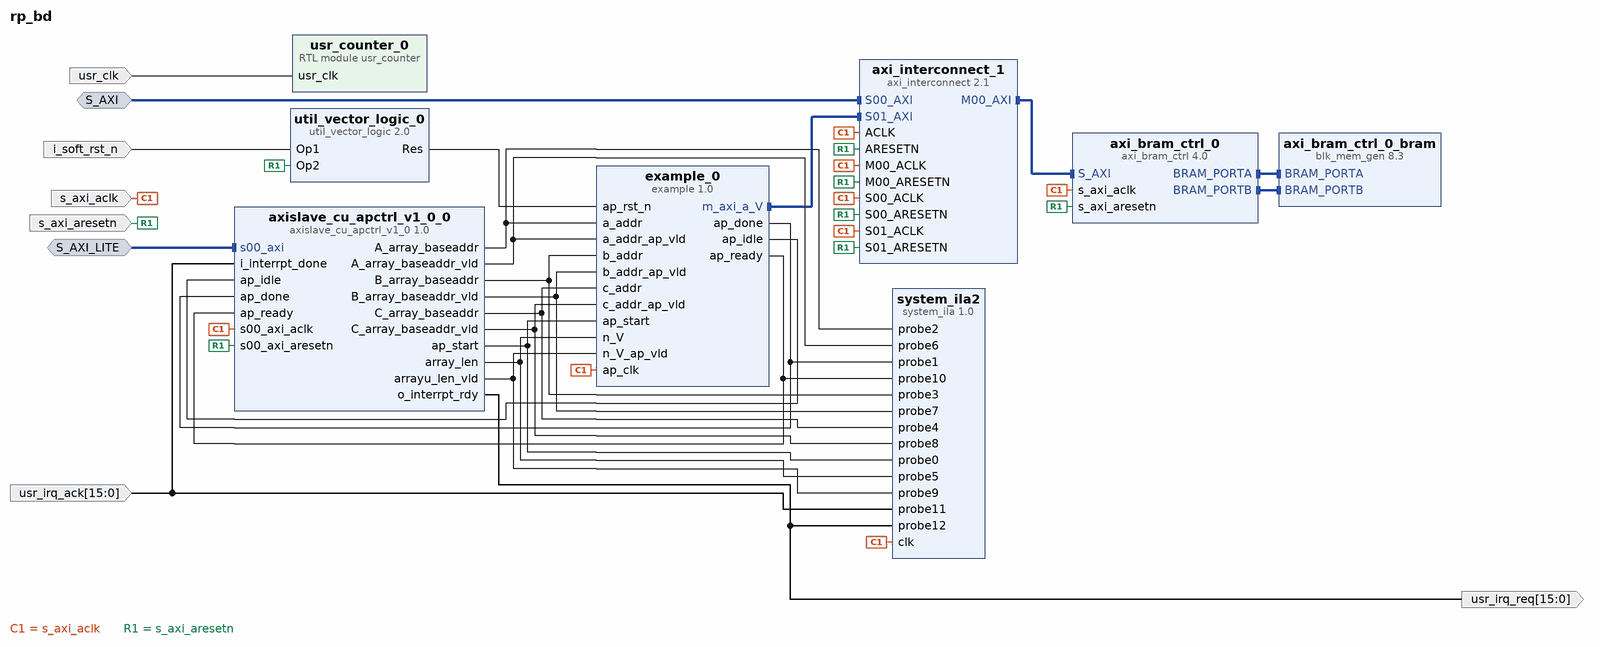
[diagram p0: block diagram of the top level]
# Vivado block design rp_bd, xcku115-flvf1924-2-e, Vivado 2016.4
create_bd_design rp_bd

create_bd_intf_port -mode Slave -vlnv xilinx.com:interface:aximm_rtl:1.0 S_AXI
set_property -dict [list \
  CONFIG.DATA_WIDTH 256 \
  CONFIG.PROTOCOL AXI4 \
  CONFIG.FREQ_HZ 250000000 \
  CONFIG.ID_WIDTH 4 \
  CONFIG.ADDR_WIDTH 64 \
  CONFIG.AWUSER_WIDTH 0 \
  CONFIG.ARUSER_WIDTH 0 \
  CONFIG.WUSER_WIDTH 0 \
  CONFIG.RUSER_WIDTH 0 \
  CONFIG.BUSER_WIDTH 0 \
  CONFIG.READ_WRITE_MODE READ_WRITE \
  CONFIG.HAS_BURST 0 \
  CONFIG.HAS_LOCK 1 \
  CONFIG.HAS_PROT 1 \
  CONFIG.HAS_CACHE 1 \
  CONFIG.HAS_QOS 0 \
  CONFIG.HAS_REGION 0 \
  CONFIG.HAS_WSTRB 1 \
  CONFIG.HAS_BRESP 1 \
  CONFIG.HAS_RRESP 1 \
  CONFIG.SUPPORTS_NARROW_BURST 0 \
  CONFIG.NUM_READ_OUTSTANDING 16 \
  CONFIG.NUM_WRITE_OUTSTANDING 16 \
  CONFIG.MAX_BURST_LENGTH 256 \
  CONFIG.CLK_DOMAIN rp_bd_axi_pcie3_0_0_axi_aclk \
  CONFIG.NUM_READ_THREADS 1 \
  CONFIG.NUM_WRITE_THREADS 1 \
  CONFIG.RUSER_BITS_PER_BYTE 0 \
  CONFIG.WUSER_BITS_PER_BYTE 0 \
] [get_bd_intf_ports S_AXI]
create_bd_intf_port -mode Slave -vlnv xilinx.com:interface:aximm_rtl:1.0 S_AXI_LITE
set_property -dict [list \
  CONFIG.DATA_WIDTH 32 \
  CONFIG.PROTOCOL AXI4LITE \
  CONFIG.FREQ_HZ 250000000 \
  CONFIG.ID_WIDTH 0 \
  CONFIG.ADDR_WIDTH 16 \
  CONFIG.AWUSER_WIDTH 0 \
  CONFIG.ARUSER_WIDTH 0 \
  CONFIG.WUSER_WIDTH 0 \
  CONFIG.RUSER_WIDTH 0 \
  CONFIG.BUSER_WIDTH 0 \
  CONFIG.READ_WRITE_MODE READ_WRITE \
  CONFIG.HAS_BURST 1 \
  CONFIG.HAS_LOCK 1 \
  CONFIG.HAS_PROT 1 \
  CONFIG.HAS_CACHE 1 \
  CONFIG.HAS_QOS 0 \
  CONFIG.HAS_REGION 0 \
  CONFIG.HAS_WSTRB 1 \
  CONFIG.HAS_BRESP 1 \
  CONFIG.HAS_RRESP 1 \
  CONFIG.SUPPORTS_NARROW_BURST 0 \
  CONFIG.NUM_READ_OUTSTANDING 8 \
  CONFIG.NUM_WRITE_OUTSTANDING 8 \
  CONFIG.MAX_BURST_LENGTH 1 \
  CONFIG.CLK_DOMAIN rp_bd_axi_pcie3_0_0_axi_aclk \
  CONFIG.NUM_READ_THREADS 1 \
  CONFIG.NUM_WRITE_THREADS 1 \
  CONFIG.RUSER_BITS_PER_BYTE 0 \
  CONFIG.WUSER_BITS_PER_BYTE 0 \
] [get_bd_intf_ports S_AXI_LITE]
create_bd_port -dir I -type rst i_soft_rst_n
create_bd_port -dir I -type clk s_axi_aclk
set_property -dict [list \
  CONFIG.FREQ_HZ 250000000 \
  CONFIG.CLK_DOMAIN rp_bd_axi_pcie3_0_0_axi_aclk \
  CONFIG.ASSOCIATED_BUSIF S_AXI:S_AXI_LITE \
] [get_bd_ports s_axi_aclk]
create_bd_port -dir I -type rst s_axi_aresetn
create_bd_port -dir I -type clk usr_clk
set_property -dict {CONFIG.PHASE 0.0 CONFIG.CLK_DOMAIN rp_bd_clk_wiz_0_0_clk_out1} [get_bd_ports usr_clk]
create_bd_port -dir I -from 15 -to 0 -type data usr_irq_ack
create_bd_port -dir O -from 15 -to 0 usr_irq_req

create_bd_cell -type ip -vlnv xilinx.com:ip:axi_bram_ctrl:4.0 axi_bram_ctrl_0
set_property -dict {CONFIG.DATA_WIDTH 256} [get_bd_cells axi_bram_ctrl_0]
create_bd_cell -type ip -vlnv xilinx.com:ip:blk_mem_gen:8.3 axi_bram_ctrl_0_bram
set_property -dict [list \
  CONFIG.Memory_Type True_Dual_Port_RAM \
  CONFIG.Enable_32bit_Address true \
  CONFIG.Write_Width_A 256 \
  CONFIG.Read_Width_A 256 \
  CONFIG.Write_Width_B 256 \
  CONFIG.Read_Width_B 256 \
  CONFIG.Register_PortA_Output_of_Memory_Primitives false \
  CONFIG.Register_PortB_Output_of_Memory_Primitives false \
  CONFIG.Use_RSTA_Pin true \
  CONFIG.Use_RSTB_Pin true \
  CONFIG.use_bram_block BRAM_Controller \
] [get_bd_cells axi_bram_ctrl_0_bram]
create_bd_cell -type ip -vlnv xilinx.com:ip:axi_interconnect:2.1 axi_interconnect_1
set_property -dict [list \
  CONFIG.NUM_SI 2 \
  CONFIG.NUM_MI 1 \
  CONFIG.M00_HAS_REGSLICE 4 \
  CONFIG.M01_HAS_REGSLICE 4 \
  CONFIG.M02_HAS_REGSLICE 4 \
  CONFIG.M03_HAS_REGSLICE 4 \
  CONFIG.M00_HAS_DATA_FIFO 1 \
  CONFIG.M01_HAS_DATA_FIFO 1 \
  CONFIG.M02_HAS_DATA_FIFO 1 \
  CONFIG.M03_HAS_DATA_FIFO 1 \
  CONFIG.S00_HAS_REGSLICE 4 \
  CONFIG.S01_HAS_REGSLICE 4 \
] [get_bd_cells axi_interconnect_1]
create_bd_cell -type ip -vlnv baidu.com:user:axislave_cu_apctrl_v1_0:1.0 axislave_cu_apctrl_v1_0_0
create_bd_cell -type ip -vlnv xilinx.com:hls:example:1.0 example_0
create_bd_cell -type ip -vlnv xilinx.com:ip:system_ila:1.0 system_ila2
set_property -dict [list \
  CONFIG.C_SLOT_0_APC_EN 0 \
  CONFIG.C_SLOT_1_APC_EN 0 \
  CONFIG.C_SLOT_0_AXI_AW_SEL_DATA 1 \
  CONFIG.C_SLOT_0_AXI_W_SEL_DATA 1 \
  CONFIG.C_SLOT_0_AXI_B_SEL_DATA 1 \
  CONFIG.C_SLOT_0_AXI_AR_SEL_DATA 1 \
  CONFIG.C_SLOT_0_AXI_R_SEL_DATA 1 \
  CONFIG.C_SLOT_1_AXI_AW_SEL_DATA 1 \
  CONFIG.C_SLOT_1_AXI_W_SEL_DATA 1 \
  CONFIG.C_SLOT_1_AXI_B_SEL_DATA 1 \
  CONFIG.C_SLOT_1_AXI_AR_SEL_DATA 1 \
  CONFIG.C_SLOT_1_AXI_R_SEL_DATA 1 \
  CONFIG.C_SLOT_0_AXI_AW_SEL_TRIG 1 \
  CONFIG.C_SLOT_0_AXI_W_SEL_TRIG 0 \
  CONFIG.C_SLOT_0_AXI_B_SEL_TRIG 1 \
  CONFIG.C_SLOT_0_AXI_AR_SEL_TRIG 1 \
  CONFIG.C_SLOT_0_AXI_R_SEL_TRIG 0 \
  CONFIG.C_SLOT_1_AXI_AW_SEL_TRIG 1 \
  CONFIG.C_SLOT_1_AXI_W_SEL_TRIG 0 \
  CONFIG.C_SLOT_1_AXI_B_SEL_TRIG 1 \
  CONFIG.C_SLOT_1_AXI_AR_SEL_TRIG 1 \
  CONFIG.C_SLOT_1_AXI_R_SEL_TRIG 0 \
  CONFIG.C_PROBE11_TYPE 0 \
  CONFIG.C_NUM_OF_PROBES 13 \
  CONFIG.C_NUM_MONITOR_SLOTS 1 \
  CONFIG.C_SLOT_0_INTF_TYPE xilinx.com:interface:aximm_rtl:1.0 \
  CONFIG.C_SLOT_1_INTF_TYPE xilinx.com:interface:aximm_rtl:1.0 \
  CONFIG.C_MON_TYPE NATIVE \
] [get_bd_cells system_ila2]
create_bd_cell -type module -reference usr_counter usr_counter_0
create_bd_cell -type ip -vlnv xilinx.com:ip:util_vector_logic:2.0 util_vector_logic_0
set_property -dict {CONFIG.C_SIZE 1} [get_bd_cells util_vector_logic_0]

# ---- connections ----

connect_bd_intf_net [get_bd_intf_pins axi_bram_ctrl_0/BRAM_PORTA] [get_bd_intf_pins axi_bram_ctrl_0_bram/BRAM_PORTA]
connect_bd_intf_net [get_bd_intf_pins axi_bram_ctrl_0/BRAM_PORTB] [get_bd_intf_pins axi_bram_ctrl_0_bram/BRAM_PORTB]
connect_bd_intf_net [get_bd_intf_pins axi_bram_ctrl_0/S_AXI] [get_bd_intf_pins axi_interconnect_1/M00_AXI]
connect_bd_intf_net [get_bd_intf_pins axi_interconnect_1/S01_AXI] [get_bd_intf_pins example_0/m_axi_a_V]
connect_bd_intf_net [get_bd_intf_ports S_AXI] [get_bd_intf_pins axi_interconnect_1/S00_AXI]
connect_bd_intf_net [get_bd_intf_ports S_AXI_LITE] [get_bd_intf_pins axislave_cu_apctrl_v1_0_0/s00_axi]
connect_bd_net -net axislave_cu_apctrl_0_A_array_baseaddr [get_bd_pins axislave_cu_apctrl_v1_0_0/A_array_baseaddr] \
  [get_bd_pins example_0/a_addr] [get_bd_pins system_ila2/probe2]
connect_bd_net -net axislave_cu_apctrl_0_A_array_baseaddr_vld [get_bd_pins axislave_cu_apctrl_v1_0_0/A_array_baseaddr_vld] \
  [get_bd_pins example_0/a_addr_ap_vld] [get_bd_pins system_ila2/probe6]
connect_bd_net -net axislave_cu_apctrl_0_B_array_baseaddr [get_bd_pins axislave_cu_apctrl_v1_0_0/B_array_baseaddr] \
  [get_bd_pins example_0/b_addr] [get_bd_pins system_ila2/probe3]
connect_bd_net -net axislave_cu_apctrl_0_B_array_baseaddr_vld [get_bd_pins axislave_cu_apctrl_v1_0_0/B_array_baseaddr_vld] \
  [get_bd_pins example_0/b_addr_ap_vld] [get_bd_pins system_ila2/probe7]
connect_bd_net -net axislave_cu_apctrl_0_C_array_baseaddr [get_bd_pins axislave_cu_apctrl_v1_0_0/C_array_baseaddr] \
  [get_bd_pins example_0/c_addr] [get_bd_pins system_ila2/probe4]
connect_bd_net -net axislave_cu_apctrl_0_C_array_baseaddr_vld [get_bd_pins axislave_cu_apctrl_v1_0_0/C_array_baseaddr_vld] \
  [get_bd_pins example_0/c_addr_ap_vld] [get_bd_pins system_ila2/probe8]
connect_bd_net -net axislave_cu_apctrl_0_ap_start [get_bd_pins axislave_cu_apctrl_v1_0_0/ap_start] \
  [get_bd_pins example_0/ap_start] [get_bd_pins system_ila2/probe0]
connect_bd_net -net axislave_cu_apctrl_0_array_len [get_bd_pins axislave_cu_apctrl_v1_0_0/array_len] \
  [get_bd_pins example_0/n_V] [get_bd_pins system_ila2/probe5]
connect_bd_net -net axislave_cu_apctrl_0_arrayu_len_vld [get_bd_pins axislave_cu_apctrl_v1_0_0/arrayu_len_vld] \
  [get_bd_pins example_0/n_V_ap_vld] [get_bd_pins system_ila2/probe9]
connect_bd_net [get_bd_pins axislave_cu_apctrl_v1_0_0/o_interrpt_rdy] [get_bd_ports usr_irq_req] [get_bd_pins system_ila2/probe12]
connect_bd_net [get_bd_pins example_0/ap_done] [get_bd_pins axislave_cu_apctrl_v1_0_0/ap_done] [get_bd_pins system_ila2/probe1]
connect_bd_net [get_bd_pins example_0/ap_idle] [get_bd_pins axislave_cu_apctrl_v1_0_0/ap_idle]
connect_bd_net [get_bd_pins example_0/ap_ready] [get_bd_pins axislave_cu_apctrl_v1_0_0/ap_ready] [get_bd_pins system_ila2/probe10]
connect_bd_net [get_bd_ports i_soft_rst_n] [get_bd_pins util_vector_logic_0/Op1]
connect_bd_net [get_bd_ports s_axi_aclk] \
  [get_bd_pins axi_bram_ctrl_0/s_axi_aclk] [get_bd_pins axi_interconnect_1/ACLK] [get_bd_pins axi_interconnect_1/M00_ACLK] \
  [get_bd_pins axi_interconnect_1/S00_ACLK] [get_bd_pins axi_interconnect_1/S01_ACLK] \
  [get_bd_pins axislave_cu_apctrl_v1_0_0/s00_axi_aclk] [get_bd_pins example_0/ap_clk] [get_bd_pins system_ila2/clk]
connect_bd_net [get_bd_ports s_axi_aresetn] \
  [get_bd_pins axi_bram_ctrl_0/s_axi_aresetn] [get_bd_pins axi_interconnect_1/ARESETN] \
  [get_bd_pins axi_interconnect_1/M00_ARESETN] [get_bd_pins axi_interconnect_1/S00_ARESETN] \
  [get_bd_pins axi_interconnect_1/S01_ARESETN] [get_bd_pins axislave_cu_apctrl_v1_0_0/s00_axi_aresetn] \
  [get_bd_pins util_vector_logic_0/Op2]
connect_bd_net [get_bd_ports usr_clk] [get_bd_pins usr_counter_0/usr_clk]
connect_bd_net [get_bd_ports usr_irq_ack] [get_bd_pins axislave_cu_apctrl_v1_0_0/i_interrpt_done] [get_bd_pins system_ila2/probe11]
connect_bd_net [get_bd_pins util_vector_logic_0/Res] [get_bd_pins example_0/ap_rst_n]

# ---- address map ----
assign_bd_address -offset 0x00000000 -range 64K -target_address_space [get_bd_addr_spaces example_0/Data_m_axi_a_V] [get_bd_addr_segs axi_bram_ctrl_0/S_AXI/Mem0]
assign_bd_address -offset 0x0000000000000000 -range 64K -target_address_space [get_bd_addr_spaces S_AXI] [get_bd_addr_segs axi_bram_ctrl_0/S_AXI/Mem0]
assign_bd_address -offset 0x0000 -range 64K -target_address_space [get_bd_addr_spaces S_AXI_LITE] [get_bd_addr_segs axislave_cu_apctrl_v1_0_0/s00_axi/reg0]

validate_bd_design
save_bd_design
